# Altium schematic sheet input_filter.SchDoc: Filtering
size A3; SheetNumber: 3; SheetTotal: 4
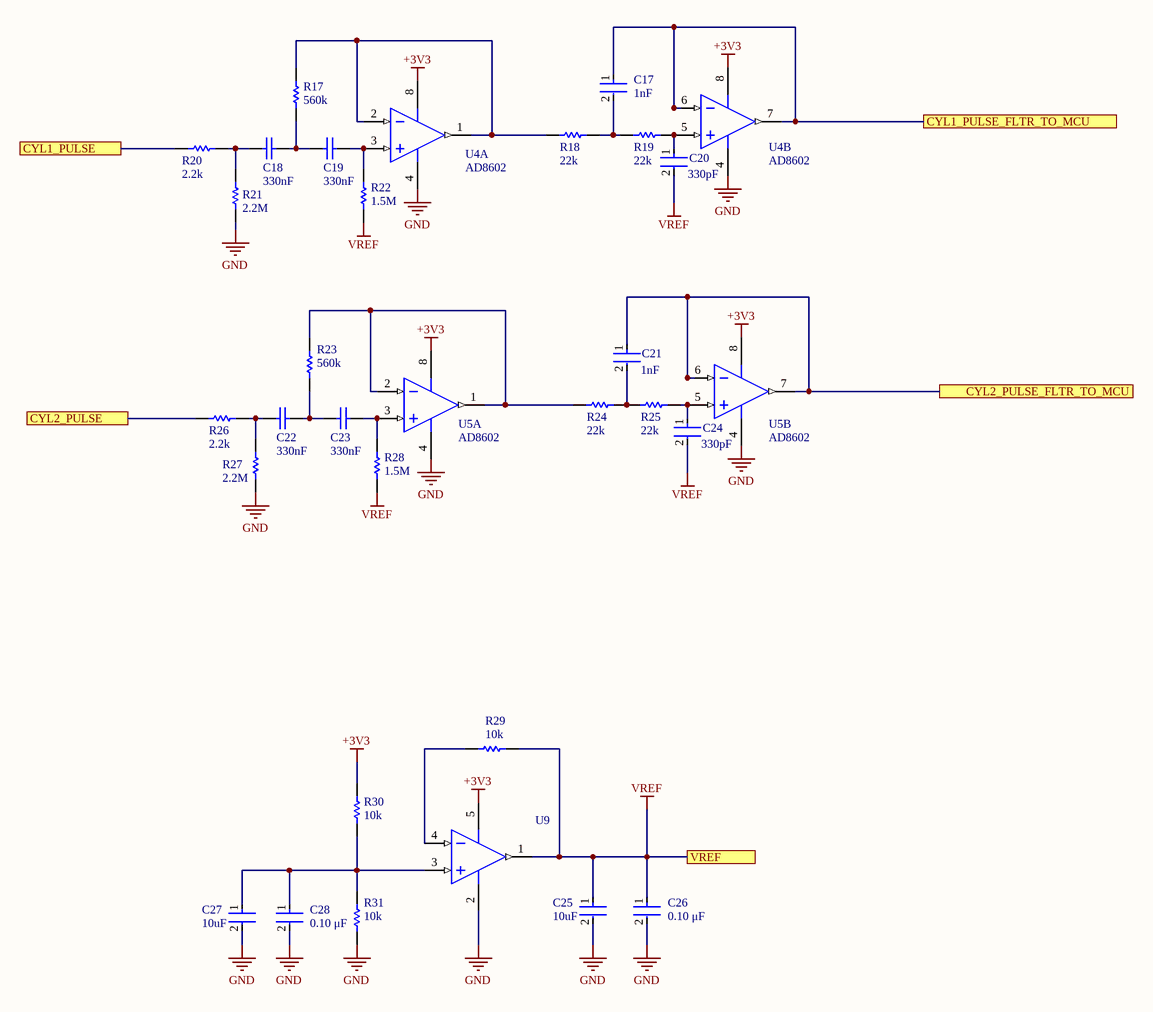
[diagram p0: input_filter.SchDoc]

## Parts
C17  Capacitance: 1nF  [FP-GRM155-0_05-IPC_B]  (hidden comment: GRM1555C1H102JA01D)
C18  value 330nF  [CAPC1005X55X25ML05T10]  (hidden comment: GRM155R61A334KE15D)
C19  value 330nF  [CAPC1005X55X25ML05T10]  (hidden comment: GRM155R61A334KE15D)
C20  Capacitance: 330pF  [FP-GRM155-0_05-MFG]  (hidden comment: GRM1555C1H331JA01D)
C21  Capacitance: 1nF  [FP-GRM155-0_05-IPC_B]  (hidden comment: GRM1555C1H102JA01D)
C22  value 330nF  [CAPC1005X55X25ML05T10]  (hidden comment: GRM155R61A334KE15D)
C23  value 330nF  [CAPC1005X55X25ML05T10]  (hidden comment: GRM155R61A334KE15D)
C24  Capacitance: 330pF  [FP-GRM155-0_05-MFG]  (hidden comment: GRM1555C1H331JA01D)
C25  Capacitance: 10uF  [FP-CL05A106MP5NUNC-MFG]  (hidden comment: CL05A106MP5NUNC)
C26  Capacitance: 0.10 μF  [FP-C0402-BB-MFG]  (hidden comment: C0402C104K8PACTU)
C27  Capacitance: 10uF  [FP-CL05A106MP5NUNC-MFG]  (hidden comment: CL05A106MP5NUNC)
C28  value 0.10 μF  [FP-C0402-BB-MFG]  (hidden comment: C0402C104K8PACTU)
R17  value 560k  [RESC1005X40X25LL05T10]  (hidden comment: RC0402FR-07560KL)
R18  value 22k  [RESC1005X40X25NL05T10]  (hidden comment: RC0402FR-0722KL)
R19  value 22k  [RESC1005X40X25NL05T10]  (hidden comment: RC0402FR-0722KL)
R20  value 2.2k  [RESC1005X40X25NL05T10]  (hidden comment: RC0402FR-0722KL)
R21  value 2.2M  [RESC1005X40X25ML05T10]  (hidden comment: RC0402FR-072M2L)
R22  value 1.5M  [RESC1005X40X25NL05T10]  (hidden comment: RC0402FR-071M5L)
R23  value 560k  [RESC1005X40X25LL05T10]  (hidden comment: RC0402FR-07560KL)
R24  value 22k  [RESC1005X40X25NL05T10]  (hidden comment: RC0402FR-0722KL)
R25  value 22k  [RESC1005X40X25NL05T10]  (hidden comment: RC0402FR-0722KL)
R26  value 2.2k  [RESC1005X40X25NL05T10]  (hidden comment: RC0402FR-0722KL)
R27  value 2.2M  [RESC1005X40X25ML05T10]  (hidden comment: RC0402FR-072M2L)
R28  value 1.5M  [RESC1005X40X25NL05T10]  (hidden comment: RC0402FR-071M5L)
R29  value 10k  [RESC1005X40X25LL05T10]  (hidden comment: RC0402FR-0710KL)
R30  value 10k  [RESC1005X40X25LL05T10]  (hidden comment: RC0402FR-0710KL)
R31  value 10k  [RESC1005X40X25LL05T10]  (hidden comment: RC0402FR-0710KL)
U4  Generic Part Number: AD8602  [ADI-RM-8_M]  (hidden comment: AD8602DRM-REEL)  (parts A,B of 2)
U5  Generic Part Number: AD8602  [ADI-RM-8_M]  (hidden comment: AD8602DRM-REEL)  (parts A,B of 2)
U9  AD8031ARTZ-REEL7  [ADI-RJ-5_L]  (value not drawn)

## Ports
CYL1_PULSE (see input_output[2B]), CYL1_PULSE_FLTR_TO_MCU (see logic_000[4A]), CYL2_PULSE (see input_output[2B]), CYL2_PULSE_FLTR_TO_MCU (see logic_000[4A]), VREF

## Nets
+3V3: R30.1 U4.8(+V) U5.8(+V) U9.5(+VS)
GND: C25.2 C26.2 C27.2 C28.2 R21.1 R27.1 R31.2 U4.4(-V) U5.4(-V) U9.2(-VS)
VREF: C20.2 C24.2 C25.1 C26.1 R22.1 R28.1 R29.1 U9.1(VOUT) ; port VREF
CYL1_PULSE: R20.1 ; port CYL1_PULSE
CYL1_PULSE_FLTR_TO_MCU: C17.1 U4.6(-IN_B) U4.7(OUT_B) ; port CYL1_PULSE_FLTR_TO_MCU
CYL2_PULSE: R26.1 ; port CYL2_PULSE
CYL2_PULSE_FLTR_TO_MCU: C21.1 U5.6(-IN_B) U5.7(OUT_B) ; port CYL2_PULSE_FLTR_TO_MCU
NetC17_2: C17.2 R18.2 R19.1
NetC18_1: C18.1 R20.2 R21.2
NetC18_2: C18.2 C19.1 R17.1
NetC19_2: C19.2 R22.2 U4.3(+IN_A)
NetC20_1: C20.1 R19.2 U4.5(+IN_B)
NetC21_2: C21.2 R24.2 R25.1
NetC22_1: C22.1 R26.2 R27.2
NetC22_2: C22.2 C23.1 R23.1
NetC23_2: C23.2 R28.2 U5.3(+IN_A)
NetC24_1: C24.1 R25.2 U5.5(+IN_B)
NetC27_1: C27.1 C28.1 R30.2 R31.1 U9.3(+IN)
NetR17_2: R17.2 R18.1 U4.1(OUT_A) U4.2(-IN_A)
NetR23_2: R23.2 R24.1 U5.1(OUT_A) U5.2(-IN_A)
NetR29_2: R29.2 U9.4(-IN)

## Library data of the parts
C17 C21 = CMP-2008-04254-2: Chip Multilayer Ceramic Capacitors for General Purpose, 0402, 1000pF, C0G, 30ppm/°C, 5%, 50V; Insulation Resistance: 10GR; Packaging: Tape and Reel; Lead Free: Lead Free; Tolerance: 5%; Temperature Coefficient: 30ppm/°C; Thickness: 0.022inch; Termination: SMD/SMT; Max Operating Temperature: 125°C; Height: 0.5mm; Package Quantity: 1; Radiation Hardening: No; Material: Ceramic; Case Code (Metric): 1005; Number of Pins: 2; Voltage Rating: 50V; Mount: Surface Mount; Voltage: 50V; Case/Package: 0402; Min Operating Temperature: -55°C; Dielectric Material: Ceramic; Width: 0.5mm; Depth: 0.5mm; Case Code (Imperial): 0402; REACH SVHC: No SVHC; Dielectric: C0G; Voltage Rating (DC): 50V; Length: 1mm
C18 C19 C22 C23 = CMP-2008-03929-1: Manufacturer: Murata; Part Number: GRM155R61A334KE15D
C20 C24 = CMP-06035-004830-1: Chip Multilayer Ceramic Capacitors for General Purpose, 0402, 330pF, C0G, 30ppm/°C, 5%, 50V; Insulation Resistance: 10GR; REACH SVHC: No SVHC; Depth: 0.5mm; Voltage Rating (DC): 50V; Number of Pins: 2; Max Operating Temperature: 125°C; Dielectric: C0G; Tolerance: 5%; Package Quantity: 1; Length: 1mm; Thickness: 0.022inch; Case/Package: 0402; Lead Free: Lead Free; Case Code (Imperial): 0402; Material: Ceramic; Voltage Rating: 50V; Voltage: 50V; Radiation Hardening: No; Min Operating Temperature: -55°C; Packaging: Tape and Reel; Case Code (Metric): 1005; Width: 0.5mm; Mount: Surface Mount; Height: 0.5mm; Temperature Coefficient: 30ppm/°C; Termination: SMD/SMT
C25 C27 = CMP-13271-000002-1: CAP CER 10UF 10V X5R 0402; Manufacturer: Samsung; Temperature Coefficient: 15%; Tolerance: 20%; Material: Ceramic; Octopart: https://octopart.com/cl05a106mp5nunc-samsung-22457395; Voltage Rating: 10V; RoHS: TRUE; Value: 10uF; Height: 0.7mm; Digikey Description: CAP CER 10UF 10V X5R 0402; Automotive: No; Package: CL05A106MP5NUNC; Device Class L1: Passive Components; Temperature Range High: +85°C; ComponentLink2Description: Datasheet; Device Class L2: Capacitors; Temperature Characteristic: X5R; Manufacturer Part Number: CL05A106MP5NUNC; Temperature: -55°C to +85°C; ComponentLink2URL: http://www.samsungsem.com/kr/support/product-search/mlcc/__icsFiles/afieldfile/2019/05/10/19-CL05A106MP5NUNC.pdf; Device Class L3: Ceramic Capacitors; Category: Cap; Temperature Range Low: -55°C; Ipc Land Pattern Name: CAPC10050X50; Lead Free: Yes
C26 = CMP-2008-02046-2: CAP CER 0.1UF 10V X5R 0402; Manufacturer: Kemet; Material: Ceramic; Temperature Coefficient: 15%; Tolerance: 0.1; Value: 0.10 μF; Package: C0402-BB; Temperature: -55°C to +125°C; ComponentLink2Description: Datasheet; Temperature Characteristic: X5R; Device Class L1: Passive Components; Height: 0.55mm; Lead Free: Yes; ComponentLink2URL: https://content.kemet.com/datasheets/KEM_C1002_X7R_SMD.pdf; Device Class L2: Capacitors; Temperature Range Low: -55°C; Temperature Range High: +125°C; RoHS: TRUE; Octopart: https://octopart.com/c0402c104k8pactu-kemet-140039; Automotive: No; Mouser Description: Capacitor 100 nF 10 VDC 0402; Category: Cap; Voltage Rating: 10 V; Digikey Description: CAP CER 0.1UF 10V X5R 0402; Ipc Land Pattern Name: CAPC10050X50; Device Class L3: Ceramic Capacitors; Manufacturer Part Number: C0402C104K8PACTU
C28 = CMP-2008-02046-2: CAP CER 0.1UF 10V X5R 0402; Manufacturer: Kemet; Material: Ceramic; Temperature Coefficient: 15%; Tolerance: 0.1; Package: C0402-BB; Temperature: -55°C to +125°C; ComponentLink2Description: Datasheet; Capacitance: 0.10 μF; Temperature Characteristic: X5R; Device Class L1: Passive Components; Height: 0.55mm; Lead Free: Yes; ComponentLink2URL: https://content.kemet.com/datasheets/KEM_C1002_X7R_SMD.pdf; Device Class L2: Capacitors; Temperature Range Low: -55°C; Temperature Range High: +125°C; RoHS: TRUE; Octopart: https://octopart.com/c0402c104k8pactu-kemet-140039; Automotive: No; Mouser Description: Capacitor 100 nF 10 VDC 0402; Category: Cap; Voltage Rating: 10 V; Digikey Description: CAP CER 0.1UF 10V X5R 0402; Ipc Land Pattern Name: CAPC10050X50; Device Class L3: Ceramic Capacitors; Manufacturer Part Number: C0402C104K8PACTU
R17 R23 = CMP-2002-07031-1: Manufacturer: Yageo / Phycomp; Part Number: RC0402FR-07560KL
R18-R20 R24-R26 = CMP-2002-07517-1: Manufacturer: Yageo / Phycomp; Part Number: RC0402FR-0722KL
  R18: ComponentLink1Description: New link; ComponentLink1URL: *
R21 R27 = CMP-2002-07061-1: Manufacturer: Yageo / Phycomp; Part Number: RC0402FR-072M2L
R22 R28 = CMP-2002-07106-1: Manufacturer: Yageo / Phycomp; Part Number: RC0402FR-071M5L
R29-R31 = CMP-2002-07353-1: Manufacturer: Yageo / Phycomp; Part Number: RC0402FR-0710KL
U4 U5 = CMP-0384-01796-1: Double Channel Wide Bandwidth Operational Amplifier, 8.4 MHz BW, 6 V/us SR, Industrial, 8-pin SOP (RM-8), Reel; Manufacturer: Analog Devices; Automotive Qualified: Yes; Amplifiers Per Package: 2; Iq/Amp: 1.2mA; Small Signal Bandwidth: 8.4MHz; Input Offset Voltage: 500uV; V Span Max: 6V; Slew Rate: 6V/us; Input Bias Current: 200fA; V Span Min: 2.7V; ComponentLink3Description: Package Specification; PackageDescription: 8-Pin Mini Small Outline Package, Body 3 x 3 mm, Pitch 0.65 mm; ComponentLink1URL: http://www.analog.com/en/index.html; ComponentLink2Description: Datasheet; PartNumber: AD8602DRM-REEL; PackageReference: RM-8; ComponentLink3URL: http://www.analog.com/static/imported-files/packages/PKG_PDF/MSOP%28RM%29/RM_8.pdf; DatasheetVersion: Rev. G; ComponentLink2URL: http://www.analog.com/static/imported-files/data_sheets/AD8601_8602_8604.pdf; Mounting Technology: Surface Mount; Code_JEDEC: MO-187-AA; ComponentLink1Description: Manufacturer URL
U9 = CMP-0384-01443-3: Single Channel RRIO Operational Amplifier, 80 MHz BW, 35 V/us SR, Industrial, 5-pin SOT23 (RJ-5), Reel; Manufacturer: Analog Devices; Generic Part Number: AD8031; V Span Max: 12V; Slew Rate: 35V/us; Input Bias Current: 450nA; Amplifiers Per Package: 1; V Span Min: 2.7V; Iq/Amp: 900uA; Small Signal Bandwidth: 80MHz; Input Offset Voltage: 1mV; ComponentLink4URL: http://www.analog.com/en/all-operational-amplifiers-op-amps/operational-amplifiers-op-amps/ad8031/products/product.html#product-recommendations; PackageDescription: 5-Pin Small Outline Transistor Package, Body 2.9 x 1.6 mm, Pitch 0.95 mm; Mounting Technology: Surface Mount; PackageReference: RJ-5; ComponentLink2Description: Datasheet; ComponentLink1Description: Manufacturer URL; PartNumber: AD8031ARTZ-REEL7; ComponentLink2URL: http://www.analog.com/static/imported-files/data_sheets/AD8031_8032.pdf; ComponentLink3URL: http://www.analog.com/static/imported-files/packages/PKG_PDF/SOT-23(RJ)/RJ_5.pdf; ComponentLink1URL: http://www.analog.com/en/index.html; RevisionNote: Reference Circuit URL fixed; ComponentLink3Description: Package Specification; ComponentLink4Description: Reference Circuit; PackageVersion: 121608-A; DatasheetVersion: Rev. D; Packing: Reel; Code_JEDEC: MO-178-AA